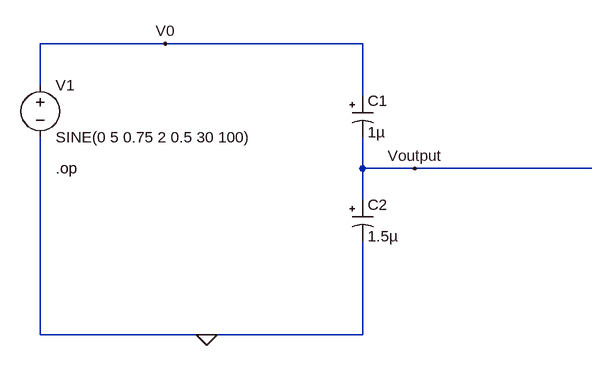
[diagram p0: schematic Capacitors- Voltage Divider Circuit.asc]
Capacitors- Voltage Divider Circuit.asc, the LTspice schematic file:
Version 4
SHEET 1 900 680
WIRE 240 160 48 160
WIRE 544 160 240 160
WIRE 48 224 48 160
WIRE 544 240 544 160
WIRE 544 352 544 304
WIRE 624 352 544 352
WIRE 896 352 624 352
WIRE 544 400 544 352
WIRE 48 608 48 304
WIRE 304 608 48 608
WIRE 544 608 544 464
WIRE 544 608 304 608
FLAG 304 608 0
FLAG 240 160 V0
FLAG 624 352 Voutput
DATAFLAG 352 160 "$"
DATAFLAG 800 352 "$"
SYMBOL voltage 48 208 R0
SYMATTR InstName V1
SYMATTR Value SINE(0 5 0.75 2 0.5 30 100)
SYMBOL polcap 528 240 R0
WINDOW 3 24 56 Left 2
SYMATTR InstName C1
SYMATTR Value 1µ
SYMATTR Description Capacitor
SYMATTR Type cap
SYMATTR SpiceLine Rser=11 Lser=0 mfg="AVX" pn="TAJA105K016" type="Tantalum"
SYMBOL polcap 528 400 R0
WINDOW 3 24 56 Left 2
SYMATTR InstName C2
SYMATTR Value 1.5µ
SYMATTR Description Capacitor
SYMATTR Type cap
SYMATTR SpiceLine Rser=8 Lser=0 mfg="AVX" pn="TAJA155K016" type="Tantalum"
TEXT 72 352 Left 2 !.op

The netlist it stands for:
* Capacitors- Voltage Divider Circuit.asc
V1 V0 0 SINE(0 5 0.75 2 0.5 30 100)
C1 V0 Voutput 1µ Rser=11 Lser=0 mfg="AVX" pn="TAJA105K016" type="Tantalum"
C2 Voutput 0 1.5µ Rser=8 Lser=0 mfg="AVX" pn="TAJA155K016" type="Tantalum"
.op
.backanno
.end